# EAGLE design scHnRk_6b (EAGLE 7.4.0)
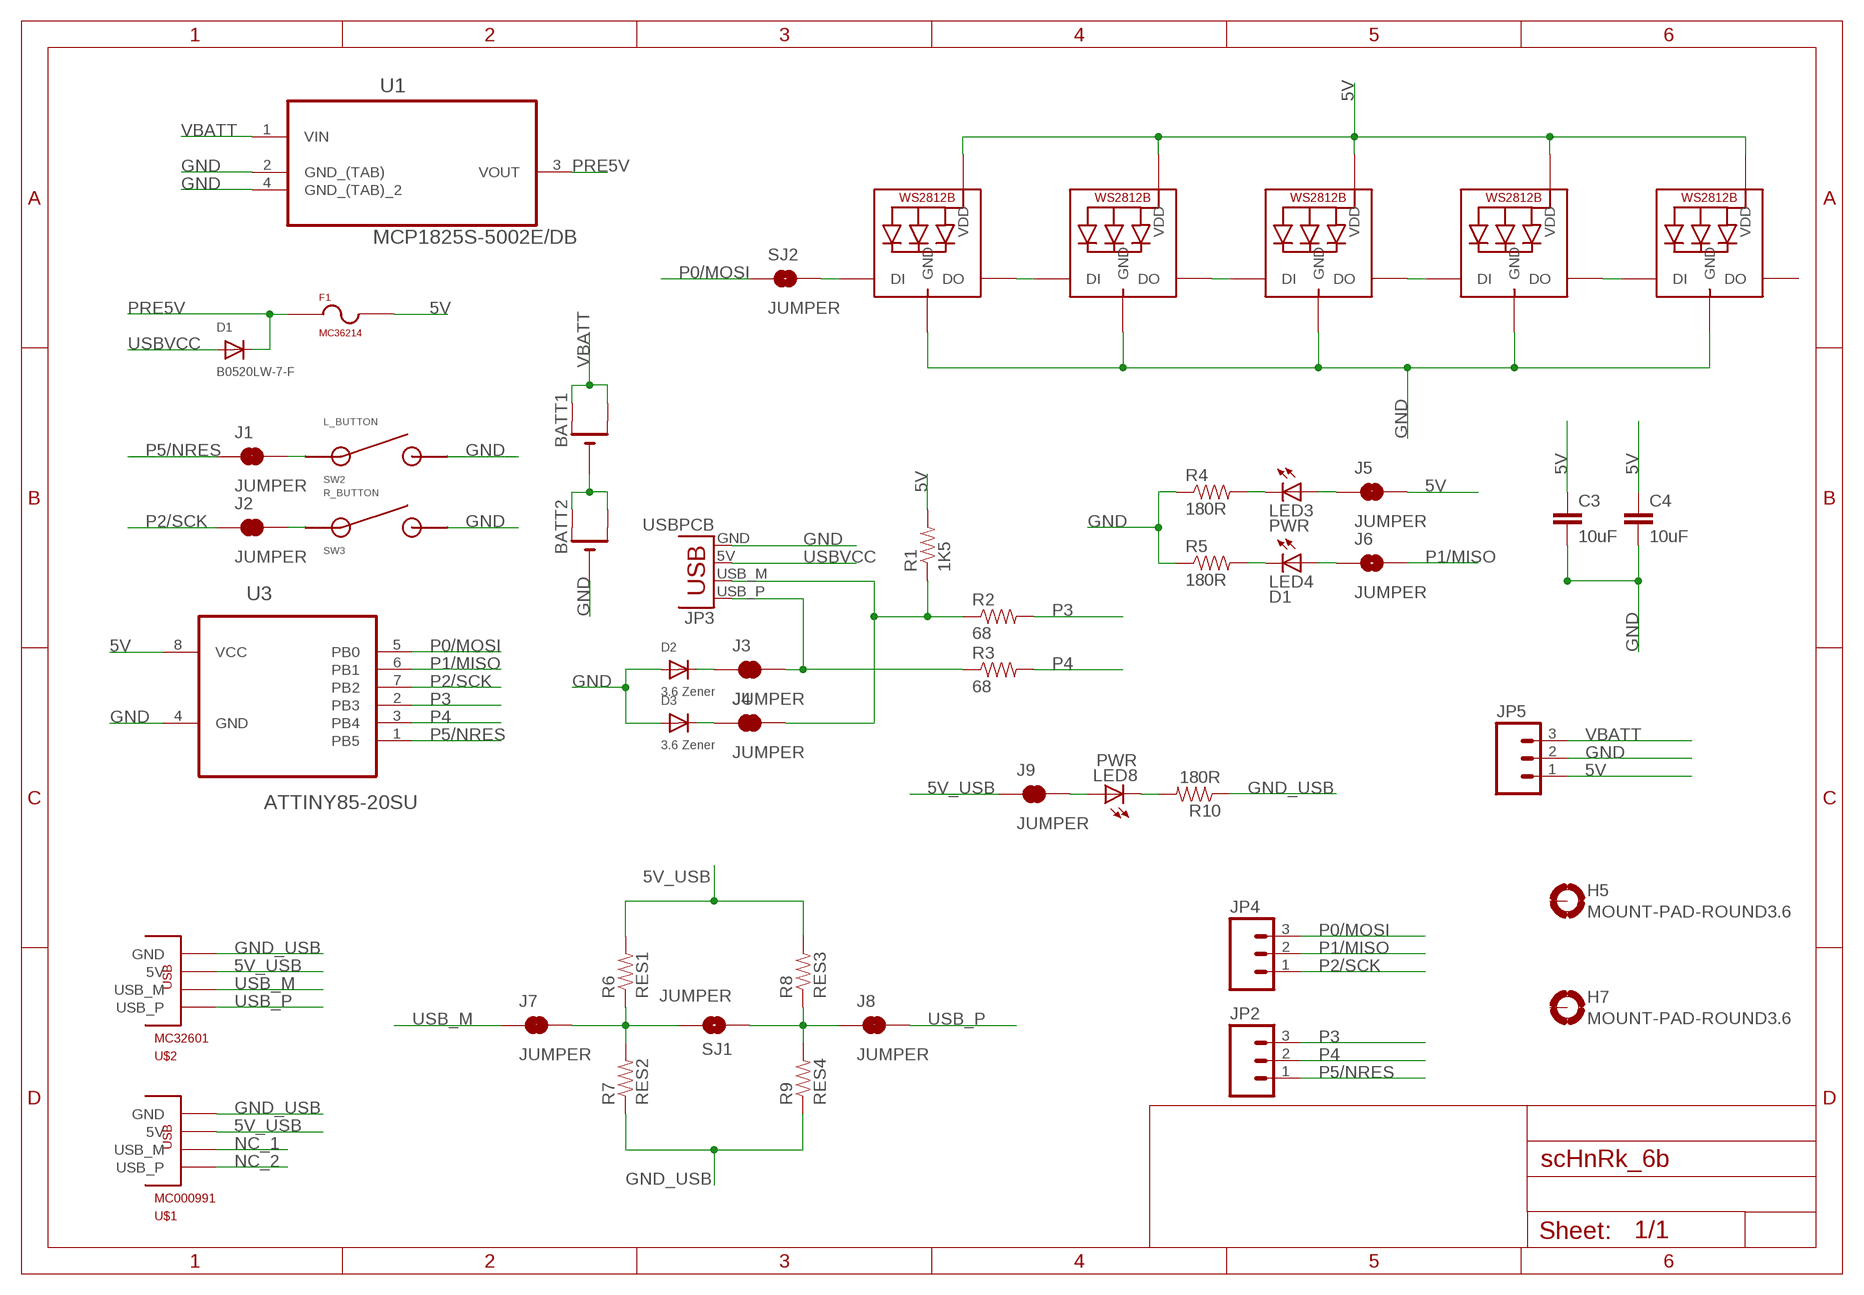
[diagram p0: schematic, sheet 1]

## Parts
BATT1  CR2032SMT  [CR2032-SMD]
BATT2  CR2032SMT  [CR2032-SMD]
C3  10uF  CAP0805  [0805]
C4  10uF  CAP0805  [0805]
D1  B0520LW-7-F  DIODESOD-123  [SOD-123]
D2  3.6 Zener  DIODESOD-523  [SOD-523]
D3  3.6 Zener  DIODESOD-523  [SOD-523]
F1  MC36214  [MC36214]
H5  MOUNT-PAD-ROUND3.6  [3,6-PAD]
H7  MOUNT-PAD-ROUND3.6  [3,6-PAD]
J1  JUMPER  JUMPER-PAD-2-NC_BY_TRACE  [PAD-JUMPER-2-NC_BY_TRACE_YES_SILK]
J2  JUMPER  JUMPER-PAD-2-NC_BY_TRACE  [PAD-JUMPER-2-NC_BY_TRACE_YES_SILK]
J3  JUMPER  JUMPER-PAD-2-NC_BY_TRACE  [PAD-JUMPER-2-NC_BY_TRACE_YES_SILK]
J4  JUMPER  JUMPER-PAD-2-NC_BY_TRACE  [PAD-JUMPER-2-NC_BY_TRACE_YES_SILK]
J5  JUMPER  JUMPER-PAD-2-NC_BY_TRACE  [PAD-JUMPER-2-NC_BY_TRACE_YES_SILK]
J6  JUMPER  JUMPER-PAD-2-NOYES_SILK  [PAD-JUMPER-2-NO_YES_SILK]
J7  JUMPER  JUMPER-PAD-2-NC_BY_TRACE  [PAD-JUMPER-2-NC_BY_TRACE_YES_SILK]
J8  JUMPER  JUMPER-PAD-2-NC_BY_TRACE  [PAD-JUMPER-2-NC_BY_TRACE_YES_SILK]
J9  JUMPER  JUMPER-PAD-2-NC_BY_TRACE  [PAD-JUMPER-2-NC_BY_TRACE_YES_SILK]
JP2  M031X03_NO_SILK  [1X03_NO_SILK]
JP3  USBPCB  [USB-A-PCB]
JP4  M031X03_NO_SILK  [1X03_NO_SILK]
JP5  M031X03_NO_SILK  [1X03_NO_SILK]
LED1  WS2812B5050  [WS2812B]
LED2  WS2812B5050  [WS2812B]
LED3  PWR  LEDCHIPLED_0603  [CHIPLED_0603]
LED4  D1  LEDCHIPLED_0603  [CHIPLED_0603]
LED5  WS2812B5050  [WS2812B]
LED6  WS2812B5050  [WS2812B]
LED7  WS2812B5050  [WS2812B]
LED8  PWR  LEDCHIPLED_0603  [CHIPLED_0603]
R1  1K5  RESISTOR0805-RES  [0805]
R2  68  RESISTOR0805-RES  [0805]
R3  68  RESISTOR0805-RES  [0805]
R4  180R  RESISTOR0805-RES  [0805]
R5  180R  RESISTOR0805-RES  [0805]
R6  RES1  RESISTOR0805-RES  [0805]
R7  RES2  RESISTOR0805-RES  [0805]
R8  RES3  RESISTOR0805-RES  [0805]
R9  RES4  RESISTOR0805-RES  [0805]
R10  180R  RESISTOR0805-RES  [0805]
SJ1  JUMPER  JUMPER-PAD-2-NOYES_SILK  [PAD-JUMPER-2-NO_YES_SILK]
SJ2  JUMPER  JUMPER-PAD-2-NOYES_SILK  [PAD-JUMPER-2-NO_YES_SILK]
SW2  L_BUTTON  SKRBAGE010  [SKRBAGE010]
SW3  R_BUTTON  SKRBAGE010  [SKRBAGE010]
U1  MCP1825S-5002E/DB  [SOT230P700X180-4N]
U3  ATTINY85-20SU  [SOIC127P798X216-8N]
U$1  MC000991  [MC000991]
U$2  MC32601  [MC32601]

## Nets
5V: C3.1 C4.1 F1.P$2 J5.2 JP5.1 LED1.1-VDD(VDD) LED2.1-VDD(VDD) LED5.1-VDD(VDD) LED6.1-VDD(VDD) LED7.1-VDD(VDD) R1.2 U3.8(VCC)
5V_USB: J9.1 R6.2 R8.2 U$1.P$4(5V) U$2.P$2(5V)
GND: BATT2.- C3.2 C4.2 D2.A D3.A JP3.GND JP5.2 LED1.3-GND(GND) LED2.3-GND(GND) LED5.3-GND(GND) LED6.3-GND(GND) LED7.3-GND(GND) R4.1 R5.1 SW2.P$2 SW2.P$4 SW3.P$2 SW3.P$4 U1.2(GND_(TAB)) U1.4(GND_(TAB)_2) U3.4(GND)
GND_USB: R7.1 R9.1 R10.1 U$1.P$1(GND) U$2.P$5(GND)
N$1: BATT1.- BATT2.+$1(+) BATT2.+$2(+1)
N$2: J1.2 SW2.P$1 SW2.P$3
N$3: LED1.2-DOUT(DO) LED2.4-DIN(DI)
N$4: LED2.2-DOUT(DO) LED5.4-DIN(DI)
N$5: LED5.2-DOUT(DO) LED6.4-DIN(DI)
N$6: LED6.2-DOUT(DO) LED7.4-DIN(DI)
N$7: J9.2 LED8.A
N$8: J2.2 SW3.P$1 SW3.P$3
N$9: D2.K(C) J3.1
N$10: D3.K(C) J4.1
N$14: LED1.4-DIN(DI) SJ2.2
N$15: J4.2 JP3.USB_M(D-) R1.1 R2.1
N$16: J3.2 JP3.USB_P(D+) R3.1
N$20: J7.2 R6.1 R7.2 SJ1.2
N$22: J8.1 R8.1 R9.2 SJ1.1
N$24: LED8.C R10.2
N$28: LED3.C R4.2
N$29: LED4.C R5.2
N$31: J5.1 LED3.A
N$34: J6.1 LED4.A
NC_1: U$1.P$3(USB_M)
NC_2: U$1.P$2(USB_P)
P0/MOSI: JP4.3 SJ2.1 U3.5(PB0)
P1/MISO: J6.2 JP4.2 U3.6(PB1)
P2/SCK: J2.1 JP4.1 U3.7(PB2)
P3: JP2.3 R2.2 U3.2(PB3)
P4: JP2.2 R3.2 U3.3(PB4)
P5/NRES: J1.1 JP2.1 U3.1(PB5)
PRE5V: D1.C F1.P$1 U1.3(VOUT)
USB_M: J7.1 U$2.P$3(USB_M)
USB_P: J8.2 U$2.P$4(USB_P)
USBVCC: D1.A JP3.5V(VBUS)
VBATT: BATT1.+$1(+) BATT1.+$2(+1) JP5.3 U1.1(VIN)
Unconnected: H5.B3,6(MOUNT) H7.B3,6(MOUNT) LED7.2-DOUT(DO)

## Library data of the parts
BATT1 BATT2 = adafruit:CR2032
C3 C4 = SparkFun-Passives:CAP: Capacitor Standard 0603 ceramic capacitor, and 0.1" leaded capacitor.
D1-D3 = adafruit:DIODE: Diode SMADIODE - SMA Surface Mount Package 20V 1A Schottky Diode Digikey: 641-1014-6-ND DO-1N4148 - Through Hole Small Current Diode SOD-123 20V 1 A (.5mV Vf) Schottky Diode - Digikey: MBRX120TPMSCT-ND SOD-323 10V 570mA (.38mV Vf, 3ns) Schottky Diode - Digikey: ZLLS410CT-ND SOD-523 30V 30mA Schottky Diode (RB751S-40TE61) - Digikey: RB751S-40TE61CT-ND SOT23-R/W - SOT23 Package (R = Solder Paste/Reflow Ovens, W = Hand-Soldering) BAT54Film 40V 300mA - Digikey: 497-7162-1-ND
F1 = scHnRk:MC36214
H5 H7 = holes:MOUNT-PAD-ROUND: MOUNTING PAD, round
J1-J5 J7-J9 = SparkFun-Passives:JUMPER-PAD-2-NC_BY_TRACE
J6 SJ1 SJ2 = SparkFun-Passives:JUMPER-PAD-2-NO
JP2 JP4 JP5 = SparkFun-Connectors:M03: Header 3 Standard 3-pin 0.1" header. Use with straight break away headers (SKU : PRT-00116), right angle break away headers (PRT-00553), swiss pins (PRT-00743), machine pins (PRT-00117), and female headers (PRT-00115). Molex polarized connector foot print use with SKU : PRT-08232 with associated crimp pins and housings.
JP3 = SparkFun-Connectors:USB: USB Connectors USB-B-PTH is fully proven SKU : PRT-00139/CONN-08278 USB-miniB is fully proven SKU : PRT-00587 USB-A-PCB is untested. USB-A-H is throughly reviewed, but untested. Spark Fun Electronics SKU : PRT-00437 USB-B-SMT is throughly reviewed, but untested. Needs silkscreen touching up. USB-A-S has not been used/tested USB-MB-H has not been used/tested USB-MICROB has been used. CONN-09505
LED1 LED2 LED5-LED7 = adafruit:WS2812B
LED3 LED4 LED8 = adafruit:LED: LED OSRAM: - CHIPLED LG R971, LG N971, LY N971, LG Q971, LY Q971, LO R971, LY R971 LH N974, LH R974 LS Q976, LO Q976, LY Q976 LO Q996 - Hyper CHIPLED LW Q18S LB Q993, LB Q99A, LB R99A - SideLED LS A670, LO A670, LY A670, LG A670, LP A670 LB A673, LV A673, LT A673, LW A673 LH A674 LY A675 LS A676, LA A676, LO A676, LY A676, LW A676 LS A679, LY A679, LG A679 - Hyper Micro SIDELED® LS Y876, LA Y876, LO Y876, LY Y876 LT Y87S - SmartLED LW L88C, LW L88S LB L89C, LB L89S, LG L890 LS L89K, LO L89K, LY L89K LS L896, LA L896, LO L896, LY L896 - TOPLED LS T670, LO T670, LY T670, LG T670, LP T670 LSG T670, LSP T670, LSY T670, LOP T670, LYG T670 LG T671, LOG T671, LSG T671 LB T673, LV T673, LT T673, LW T673 LH T674 LS T676, LA T676, LO T676, LY T676, LB T676, LH T676, LSB T676, LW T676 LB T67C, LV T67C, LT T67C, LS T67K, LO T67K, LY T67K, LW E67C LS E67B, LA E67B, LO E67B, LY E67B, LB E67C, LV E67C, LT E67C LW T67C LS T679, LY T679, LG T679 LS T770, LO T770, LY T770, LG T770, LP T770 LB T773, LV T773, LT T773, LW T773 LH T774 LS E675, LA E675, LY E675, LS T675 LS T776, LA T776, LO T776, LY T776, LB T776 LHGB T686 LT T68C, LB T68C - Hyper Mini TOPLED® LB M676 - Mini TOPLED Santana® LG M470 LS M47K, LO M47K, LY M47K Source: http://www.osram.convergy.de/
R1-R10 = SparkFun-Passives:RESISTOR: Resistor Basic schematic elements and footprints for 0603, 1206, and PTH resistors.
SW2 SW3 = scHnRk:SKRBAGE010
U1 = Microchip_By_element14_Batch_1:MCP1825S-5002E/DB: IC, LDO, 5.0V, 500MA; MPN: MCP1825S-5002E/DB; OC_FARNELL: 1578407; OC_NEWARK: 26M9964; PACKAGE: SOT-223-3; SUPPLIER: Microchip
U3 = Atmel_By_element14_Batch_1-00:ATTINY85-20SU: 8-bit Microcontroller with In-System Programmable Flash; MPN: ATTINY85-20SU; OC_FARNELL: 1455164; OC_NEWARK: 58M3797; PACKAGE: SOIC-8; SUPPLIER: Atmel
U$1 = scHnRk:MC000991
U$2 = scHnRk:MC32601

## Net classes
0 default: clearance 0.305 mm

## Board
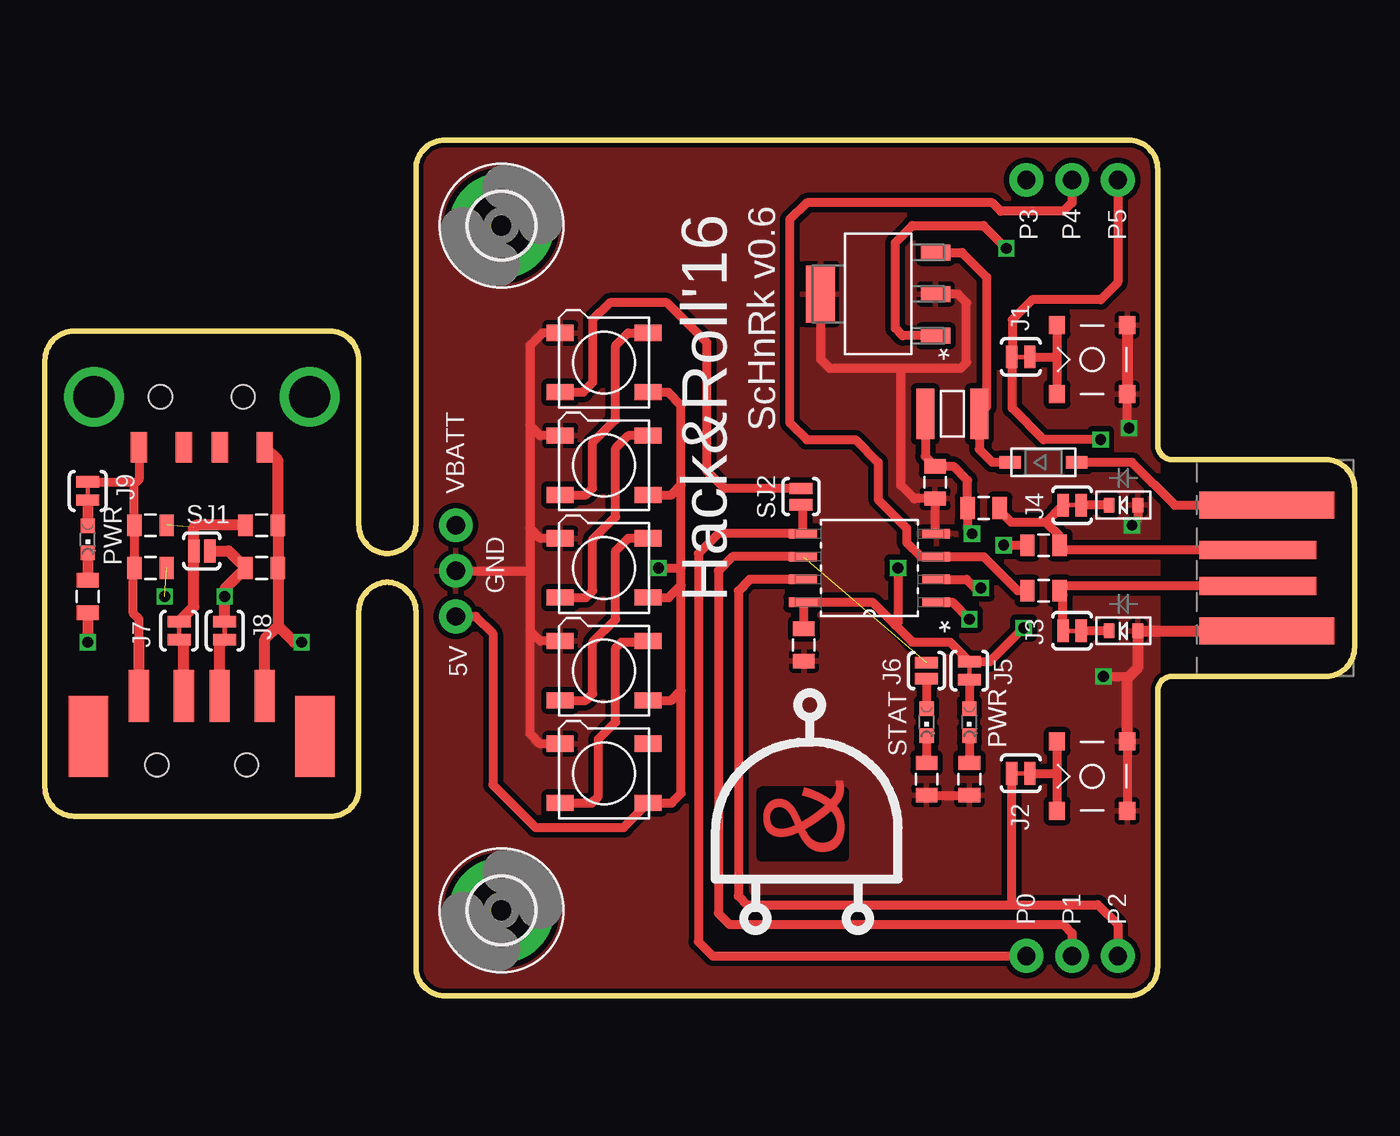
[diagram p1: board, top side]
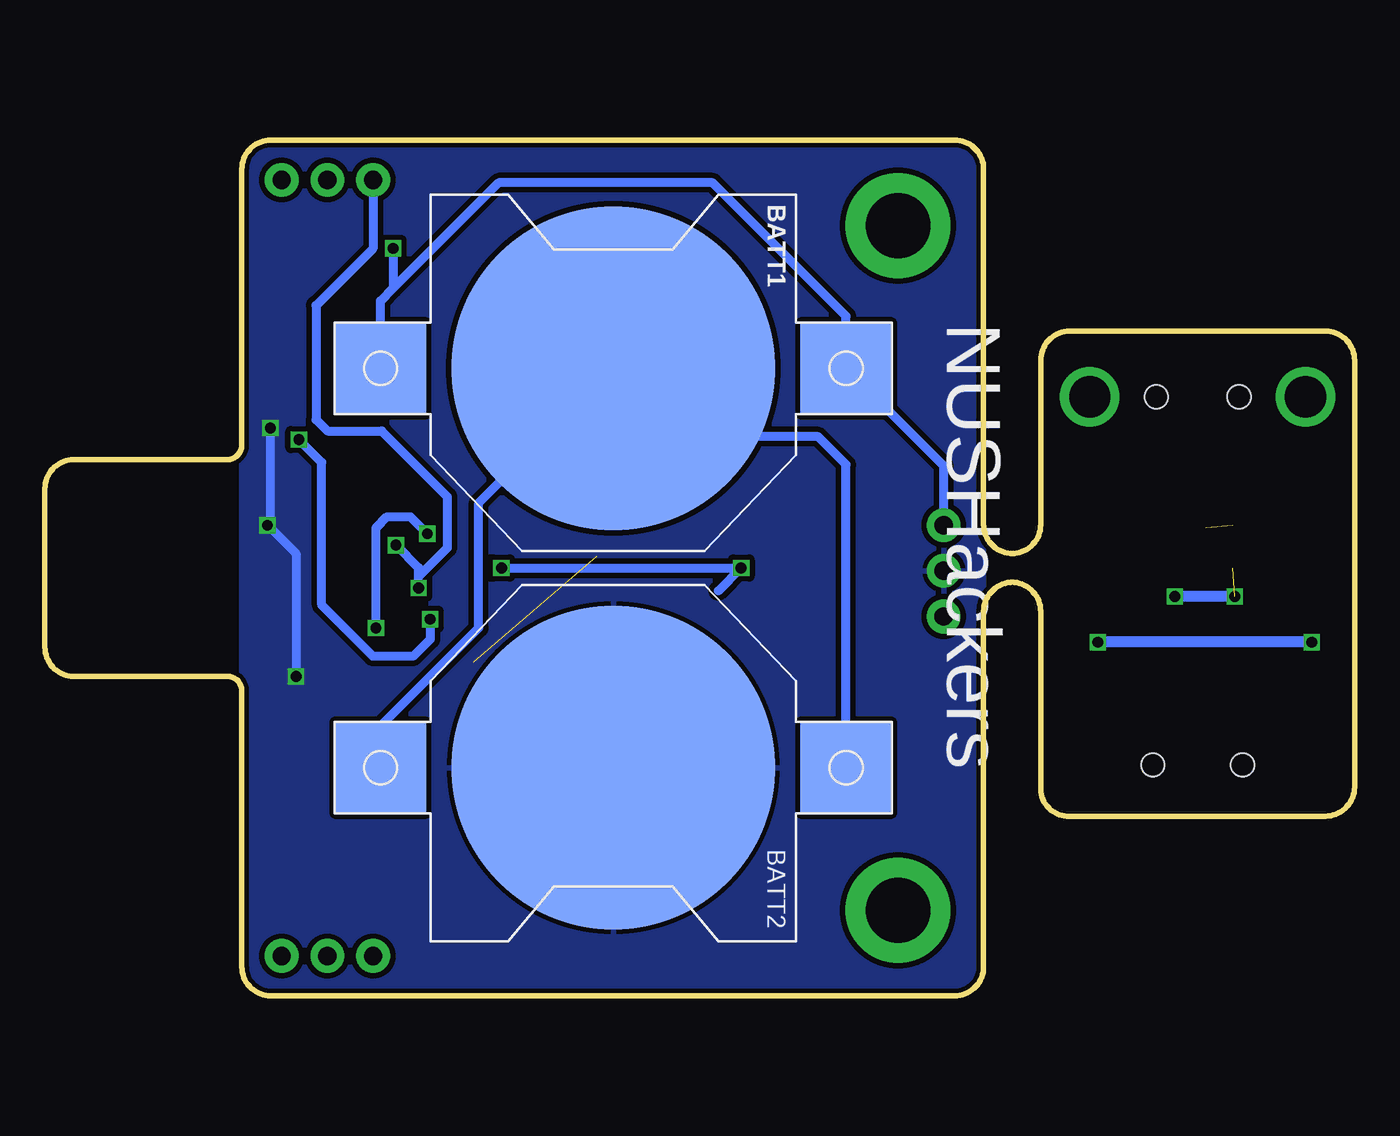
[diagram p2: board, bottom side, seen from below]

Size 72.87 x 47.62 mm. Coordinates in mm from the lower left corner, seen from the top.
Outline: 20.64,19.98 20.64,1.63 arc90 22.26,0 60.29,0 arc90 61.91,1.63 61.91,16.97 arc-90 62.73,17.78 71.24,17.78 arc90 72.87,19.41 72.87,28.22 arc90 71.24,29.84 62.73,29.84 arc-90 61.91,30.66 61.91,46 arc90 60.29,47.62 22.26,47.62 arc90 20.64,46 20.64,27.64
Outline: 20.64,20 20.64,21.08
Outline: 20.64,27.62 20.64,26.23 arc-90 19.01,24.61 19.09,24.61 arc-90 17.46,26.23 17.46,26.83
Outline: 17.46,26.87 17.46,35.36 arc90 15.84,36.99 1.63,36.99 arc90 0,35.36 0,11.63 arc90 1.63,10 16,10 arc90 17.46,11.63 17.46,21.39 arc-90 19.09,23.02 19.01,23.02 arc-90 20.64,21.39 20.64,21.11
Copper layers (1*16): Top 0.035mm / dielectric 1.5mm / Bottom 0.035mm
Design rules "dirt_cheap_dirty_boards.v1": minimum track width 5mil, minimum drill 12mil, track to track 5mil, track to pad 5mil, pad to pad 5mil, via to via 5mil, smd to smd 0mil, copper to edge 10mil, drill to drill 10mil, minimum pad ring 10mil, minimum via ring 6mil, stop-mask expansion 2mil, vias tented up to drill 25mil, thermal gap 10mil

### Footprints (pad centres in the part's own frame; a part is rotated, then mirrored left to right if it is on the bottom)
CR2032-SMD = smd 5.08 x 5.08: +$1 -12.954,0; +$2 12.954,0 | smd 18 x 18: - 0,0
0805 = smd 0.8 x 1.2: 1 -0.9,0; 2 0.9,0
SOD-123 = smd 1.2 x 0.7: A 1.85,0; C -1.85,0
SOD-523 = smd 0.8 x 0.6: A 0,-0.8; K 0,0.8
MC36214 = smd 1 x 2.8: P$1 -1.5,0; P$2 1.5,0
3,6-PAD = drill 3.6 pad 5.842: B3,6 0,0
PAD-JUMPER-2-NC_BY_TRACE_YES_SILK = smd 0.635 x 1.27: 1 -0.508,0; 2 0.508,0
PAD-JUMPER-2-NO_YES_SILK = smd 0.635 x 1.27: 1 -0.45,0; 2 0.45,0
1X03_NO_SILK = drill 1.016 pad 1.88: 1 0,0; 2 2.54,0; 3 5.08,0
USB-A-PCB = smd 7.5 x 1.5: 5V -0.2,-3.5; GND -0.2,3.5 | smd 6.5 x 1: USB_M 0.3,-1; USB_P 0.3,1
WS2812B = smd 1.5 x 0.9: 1-VDD 2.45,-1.65; 2-DOUT 2.45,1.65; 3-GND -2.45,1.65; 4-DIN -2.45,-1.65
CHIPLED_0603 = smd 0.8 x 0.8: A 0,-0.75; C 0,0.75
SKRBAGE010 = smd 1 x 0.9: P$1 -1.925,1.95; P$2 -1.925,-1.95; P$3 1.925,1.95; P$4 1.925,-1.95
SOT230P700X180-4N = smd 1.626 x 0.889: 1 -3.2,2.311; 2 -3.2,0; 3 -3.2,-2.311 | smd 1.626 x 3.175: 4 3.2,0
SOIC127P798X216-8N = smd 1.549 x 0.533: 1 -3.708,1.905; 2 -3.708,0.635; 3 -3.708,-0.635; 4 -3.708,-1.905; 5 3.708,-1.905; 6 3.708,-0.635; 7 3.708,0.635; 8 3.708,1.905
MC000991 = smd 0.9 x 1.7: P$1 -3.5,2.8; P$2 -1,2.8; P$3 1,2.8; P$4 3.5,2.8 | drill 2.3: P$5 -6,0; P$6 6,0 | hole 1.3: -2.3,0; 2.3,0
MC32601 = smd 2.2 x 4.5: P$1 -6.3,1.59; P$6 6.3,1.59 | smd 1.12 x 2.88: P$2 -3.5,3.84; P$3 -1,3.84; P$4 1,3.84; P$5 3.5,3.84 | hole 1.3: -2.5,0; 2.5,0

### Placement (x,y rotation side)
BATT1  41.24,34.92 0 bottom
BATT2  41.24,12.7 180 bottom
C3  42.23,19.53 270 top
C4  49.53,28.57 270 top
D1  55.56,29.69 0 top
D2  60.01,20.32 90 top
D3  60.01,27.3 90 top
F1  50.48,32.38 180 top
H5  25.4,4.76 0 top
H7  25.4,42.86 0 top
J1  54.29,35.56 0 top
J2  54.29,12.38 0 top
J3  57.15,20.32 180 top
J4  57.15,27.3 180 top
J5  51.43,18.1 90 top
J6  49.05,18.1 90 top
J7  7.46,20.32 90 top
J8  10,20.32 270 top
J9  2.38,28.1 270 top
JP2  59.69,45.4 180 top
JP3  67.79,23.81 180 top
JP4  59.69,2.22 180 top
JP5  22.86,21.11 90 top
LED1  31.12,35.24 0 top
LED2  31.12,29.53 0 top
LED3  51.43,15.24 180 top
LED4  49.05,15.24 180 top
LED5  31.12,23.81 0 top
LED6  31.12,18.1 0 top
LED7  31.12,12.38 0 top
LED8  2.38,25.4 180 top
R1  52.23,27.15 180 top
R2  55.56,25.08 180 top
R3  55.56,22.54 180 top
R4  51.43,12.06 90 top
R5  49.05,12.06 90 top
R6  5.87,26.19 180 top
R7  12.06,26.19 180 top
R8  5.87,23.81 180 top
R9  12.06,23.81 180 top
R10  2.38,22.23 90 top
SJ1  8.73,24.77 180 top
SJ2  42.07,27.78 90 top
SW2  58.26,35.4 90 top
SW3  58.26,12.22 90 top
U1  46.35,39.05 180 top
U3  45.88,23.81 180 top
U$1  8.73,33.34 180 top
U$2  8.73,12.86 0 top

### Tracks (layer width: path | path; a pad name or v marks a point on that pad's centre or on a via)
5V  (via drill 0.6)
  Top 0.508: v51.59,25.72 51.33,25.98 R1.2 51.33,28.68 50.54,29.48 C4.1 48.98,30.02 F1.P$2 | 35.4,16.99 35.4,11.27 34.86,10.73 LED7.1-VDD 32.2,9.37 27.3,9.37 24.92,11.75 24.92,20.16 23.97,21.11 JP5.1 | 35.4,16.99 35.4,22.86 | 35.4,22.86 35.4,23.81 | 35.4,23.81 35.4,28.42 | 35.4,28.42 35.4,32.86 34.67,33.59 LED1.1-VDD | LED2.1-VDD 34.86,27.88 35.4,28.42 | LED5.1-VDD 34.7,22.16 35.4,22.86 | LED6.1-VDD 34.86,16.45 35.4,16.99 | v54.45,20.48 52.58,18.61 J5.2 50.36,19.68 48.26,19.68 47.31,20.64 | v34.13,23.81 35.4,23.81 | 47.31,20.64 46.04,21.91 U3.8 42.23,21.85 C3.1 | v47.47,23.81 47.47,20.8 47.31,20.64
  Bottom 0.508: v54.45,20.48 54.45,26.04 53.82,26.67 52.55,26.67 v51.59,25.72 | 35.4,22.54 v34.13,23.81 | 33.97,23.65 v34.13,23.81 | v47.47,23.81 v34.13,23.81
5V_USB
  Top 0.508: 5.23,19.85 5.23,20.96 4.92,21.27 4.92,23.76 R8.2 R6.2 4.97,28.47 5.11,28.61 | U$1.P$4 5.23,28.73 5.11,28.61 | J9.1 5.11,28.61
  Top 0.61: U$2.P$2 5.23,19.85
GND  (via drill 0.6)
  Top 0.508: LED1.3-GND 27.69,36.89 26.99,36.2 26.99,31.75 | 26.99,31.75 26.99,26.04 | 26.99,26.04 26.99,23.5 | 26.99,23.5 26.99,20.32 | LED6.3-GND 27.56,19.75 26.99,20.32 | LED7.3-GND 27.56,14.03 26.99,14.61 26.99,20.32 | LED5.3-GND 27.56,25.46 26.99,26.04 | LED2.3-GND 27.56,31.18 26.99,31.75 | SW3.P$4 SW3.P$2 | R5.1 R4.1 | v58.9,17.78 60.21,17.78 60.21,17.62 | U3.4 49.53,25.77 C4.2 48.37,27.68 47.62,28.42 47.62,34.77 47.78,34.92 | SW2.P$2 60.21,31.7 v60.32,31.59 | D3.A 60.81,26.52 v60.48,26.19 | U1.4 43.15,35.43 43.66,34.92 47.78,34.92 | 47.78,34.92 50.96,34.92 51.28,35.24 51.28,38.58 50.8,39.05 U1.2 | JP5.2 26.83,23.65 26.99,23.5
  Top 0.61: SW2.P$4 SW2.P$2 | JP3.GND 67.98,20.32 D2.A 60.81,18.26 60.21,17.67 60.21,17.62 SW3.P$4
  Bottom 0.508: v60.32,31.59 60.32,26.35 v60.48,26.19 58.9,24.61 v58.9,17.78
  pour Top: 21.45,47.62 61.1,47.62 arc-90 61.91,46.81 61.91,0.81 arc-90 61.1,0 21.45,0 arc-90 20.64,0.81 20.64,46.81 arc-90
  pour Bottom: 21.45,47.62 61.1,47.62 arc-90 61.91,46.81 61.91,0.81 arc-90 61.1,0 21.45,0 arc-90 20.64,0.81 20.64,46.81 arc-90
GND_USB  (via drill 0.6)
  Top 0.61: U$1.P$1 12.96,29.8 R7.1 R9.1 12.96,20.59 | U$2.P$5 12.23,19.85 12.96,20.59 | R10.1 v2.38,19.68 | v14.29,19.68 13.87,19.68 12.96,20.59
  Bottom 0.61: v2.38,19.68 v14.29,19.68
N$1
  Bottom 0.508: BATT2.+$1 28.29,29.56 29.84,31.11 37.43,31.11 BATT1.- 48.74,27.43 48.74,20.48 54.2,15.02 BATT2.+$2
N$2
  Top 0.508: SW2.P$3 56.31,35.72 | 56.31,35.72 SW2.P$1 | J1.2 56.15,35.56 56.31,35.72
N$3
  Top 0.508: LED2.4-DIN 30.1,27.88 30.48,28.26 30.48,30.8 31.75,32.07 31.75,36.2 32.45,36.89 LED1.2-DOUT
N$4
  Top 0.508: LED5.4-DIN 30.1,22.16 30.48,22.54 30.48,25.4 31.75,26.67 31.75,30.48 32.45,31.18 LED2.2-DOUT
N$5
  Top 0.508: LED6.4-DIN 30.1,16.45 30.48,16.83 30.48,19.68 31.75,20.95 31.75,24.77 32.45,25.46 LED5.2-DOUT
N$6
  Top 0.508: LED7.4-DIN 30.42,10.73 30.8,11.11 30.8,14.29 31.75,15.24 31.75,19.37 32.07,19.68 33.5,19.68 LED6.2-DOUT
N$7
  Top 0.61: J9.2 LED8.A
N$8
  Top 0.508: SW3.P$3 56.31,12.38 | 56.31,12.38 SW3.P$1 | J2.2 56.31,12.38
N$9
  Top 0.508: D2.K J3.1
N$10
  Top 0.508: D3.K J4.1
N$14
  Top 0.508: LED1.4-DIN 29.94,33.59 30.48,34.13 30.48,37.62 31.43,38.58 34.61,38.58 36.83,36.35 36.83,29.21 37.81,28.23 SJ2.2
N$15
  Top 0.508: JP3.USB_M 56.68,24.81 R2.1 56.46,25.58 55.69,26.35 | 55.69,26.35 J4.2 | 55.69,26.35 53.76,26.35 53.13,26.99 R1.1
N$16
  Top 0.508: JP3.USB_P 56.68,22.81 R3.1 56.64,22.31 J3.2
N$20  (1 unrouted)
  Top 0.61: R7.2 8.41,26.19 8.28,26.06 SJ1.2 8.28,21.65 J7.2
N$22  (via drill 0.6)  (1 unrouted)
  Top 0.61: J8.1 v10,22.23 10,22.65 R9.2 10.21,24.77 SJ1.1
  Bottom 0.61: v6.67,22.23 v10,22.23
N$24
  Top 0.61: LED8.C R10.2
N$28
  Top 0.508: LED3.C R4.2
N$29
  Top 0.508: LED4.C R5.2
N$31
  Top 0.508: J5.1 LED3.A
N$34
  Top 0.508: J6.1 LED4.A
P0/MOSI
  Top 0.508: SJ2.1 42.17,27.23 U3.5 37.46,25.72 36.35,24.61 36.35,3.02 37.15,2.22 JP4.3
P1/MISO  (1 unrouted)
  Top 0.508: JP4.2 57.15,3.49 56.67,3.97 38.1,3.97 37.46,4.6 37.46,23.65 38.26,24.45 U3.6
P2/SCK
  Top 0.508: U3.7 39.21,23.18 38.58,22.54 38.58,5.56 39.05,5.08 53.98,5.08 | 53.98,5.08 58.58,5.08 59.69,3.97 JP4.1 | J2.1 53.79,5.27 53.98,5.08
P3  (via drill 0.6)
  Top 0.508: U3.2 51.28,23.18 51.75,22.7 v52.07,22.7 | v53.34,25.08 R2.2
  Bottom 0.508: v52.07,22.7 52.07,23.34 | 52.07,23.34 52.07,23.81 v53.34,25.08 | JP2.3 54.61,41.59 57.79,38.42 57.79,32.07 57.15,31.43 54.13,31.43 50.48,27.78 50.48,24.92 52.07,23.34
P4
  Top 0.508: R3.2 54.13,22.54 52.23,24.45 U3.3 48.74,24.45 47.94,25.24 47.94,26.04 46.35,27.62 46.35,29.69 45.09,30.96 42.39,30.96 41.43,31.91 41.43,43.18 42.39,44.13 52.71,44.13 53.18,43.66 56.67,43.66 57.15,44.13 JP2.2
P5/NRES  (via drill 0.6)
  Top 0.508: U3.1 50.48,21.91 v51.43,20.95 | JP2.1 59.69,39.69 58.74,38.73 54.93,38.73 53.82,37.62 53.82,35.59 J1.1 53.82,35.53 53.82,32.7 55.56,30.96 v58.74,30.96
  Bottom 0.508: v51.43,20.95 51.43,19.84 52.39,18.89 54.61,18.89 57.47,21.75 57.47,29.69 v58.74,30.96
PRE5V
  Top 0.508: D1.C 52.71,29.69 51.98,30.41 F1.P$1 52.39,32.79 52.39,40.01 51.03,41.36 U1.3
USB_M
  Top 0.61: U$2.P$3 7.73,19.54 J7.1
USB_P
  Top 0.61: U$2.P$4 9.73,19.54 J8.2
USBVCC
  Top 0.508: D1.A 60.48,29.69 62.86,27.31 JP3.5V
VBATT  (via drill 0.6)
  Top 0.508: U1.1 47.71,36.74 47.31,37.15 47.31,41.91 48.26,42.86 52.23,42.86 v53.5,41.59
  Bottom 0.508: BATT1.+$1 54.2,38.67 53.5,39.37 | 53.5,39.37 47.62,45.24 35.72,45.24 28.29,37.81 BATT1.+$2 22.86,29.5 JP5.3 | v53.5,41.59 53.5,39.37

### Text on the board
Top: &
tPlace: Hack&Roll'16
tNames: P3 | P4 | P5 | ScHnRk v0.6 | VBATT | PWR | GND | 5V | PWR | PWR | STAT | P0 | P1 | P2
bNames: NUSHackers
tStop: &